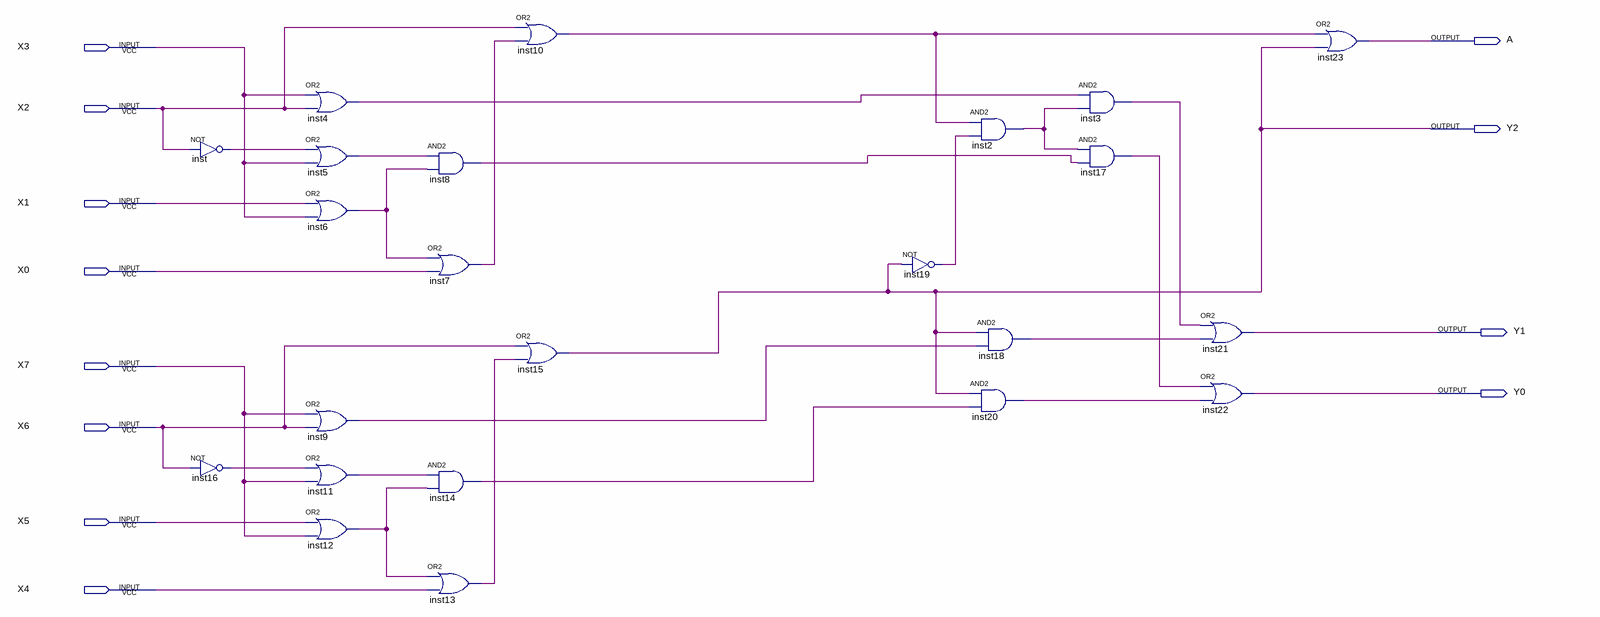
[diagram p0: schematic sheet]
// Quartus schematic q5completo.bdf as structural Verilog: 23 symbols, 12 pins
module q5completo (
  input  X3,
  input  X2,
  input  X1,
  input  X0,
  input  X7,
  input  X6,
  input  X5,
  input  X4,
  output A,
  output Y2,
  output Y1,
  output Y0
);

  wire inst2_out, inst3_out, inst4_out, inst5_out, inst6_out, inst7_out, inst8_out, inst9_out, inst10_out,
       inst11_out, inst12_out, inst13_out, inst14_out, inst16_out, inst17_out, inst18_out, inst19_out,
       inst20_out, inst_out;

  not inst (inst_out, X2);
  not inst16 (inst16_out, X6);
  or inst4 (inst4_out, X3, X2);
  or inst5 (inst5_out, inst_out, X3);
  or inst6 (inst6_out, X1, X3);
  or inst9 (inst9_out, X7, X6);
  or inst11 (inst11_out, inst16_out, X7);
  or inst12 (inst12_out, X5, X7);
  and inst8 (inst8_out, inst5_out, inst6_out);
  or inst7 (inst7_out, inst6_out, X0);
  and inst14 (inst14_out, inst11_out, inst12_out);
  or inst13 (inst13_out, inst12_out, X4);
  or inst10 (inst10_out, X2, inst7_out);
  or inst15 (Y2, X6, inst13_out);
  not inst19 (inst19_out, Y2);
  and inst2 (inst2_out, inst10_out, inst19_out);
  and inst18 (inst18_out, Y2, inst9_out);
  and inst20 (inst20_out, Y2, inst14_out);
  and inst3 (inst3_out, inst4_out, inst2_out);
  and inst17 (inst17_out, inst2_out, inst8_out);
  or inst21 (Y1, inst3_out, inst18_out);
  or inst22 (Y0, inst17_out, inst20_out);
  or inst23 (A, inst10_out, Y2);
endmodule
